# EasyEDA schematic Second_vehicle.json
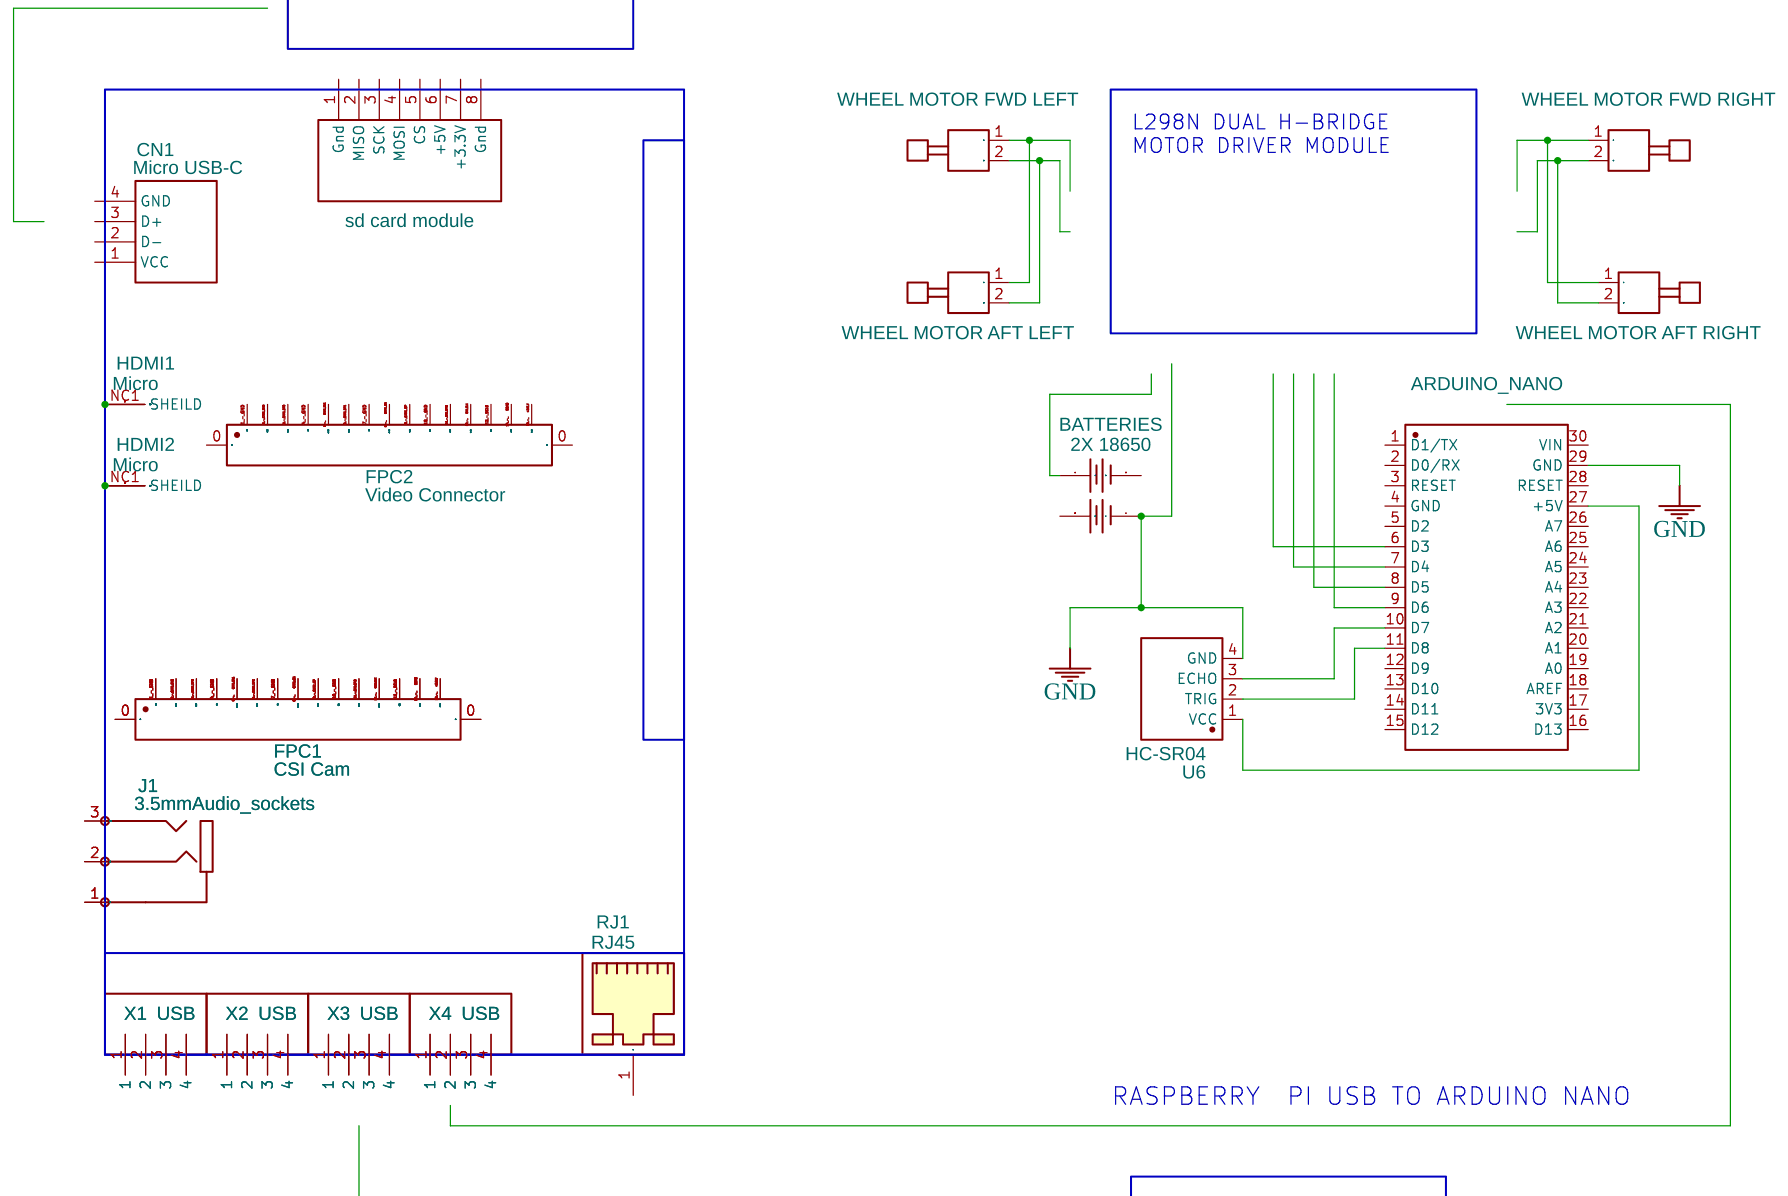
[diagram p0: schematic sheet]

## Parts
BATTERIES  2X 18650  [BAT-TH_BH-18650-A1BJ034]
CN1  Micro USB-C  [USB-A-SMD_4PIN-FEMALE_AF]
FPC1  CSI Cam  [FFC-S-C1.0-5.5-15P]
FPC2  Video Connector  [FFC-S-C1.0-5.5-15P]
HDMI1  Micro  [HDMI]
HDMI2  Micro  [HDMI]
J1  3.5mmAudio_sockets  [AUDIO-JACK-3.5]
RJ1  RJ45  [RJ45-LIGHT-90]
U1  ARDUINO_NANO  [COMM-TH_ARDUINO_NANO]
U2  WHEEL MOTOR FWD LEFT  [MOTOR_LCM04084521-B1]
U3  WHEEL MOTOR FWD RIGHT  [MOTOR_LCM04084521-B1]
U4  WHEEL MOTOR AFT LEFT  [MOTOR_LCM04084521-B1]
U5  WHEEL MOTOR AFT RIGHT  [MOTOR_LCM04084521-B1]
U6  HC-SR04  [TH_HC-SR04V]
U7  sd card module  [SD CARD MODULE W/ SD CARD]
X1  USB  [USB-A-S]
X2  USB  [USB-A-S]
X3  USB  [USB-A-S]
X4  USB  [USB-A-S]

## Library data of the parts
BATTERIES = BH-18650-A1BJ034: Supplier: LCSC; Supplier Part: C49215506; Manufacturer: MYOUNG(美阳); JLCPCB Part Class: Extended Part; Contributor: lcsc
CN1 = -: Supplier: LCSC; Manufacturer: ValuePro; Manufacturer Part: USB-CONN-AF-LCP; image: //image.lceda.cn/szlcsc/C42641.jpg; Supplier Part: C42641; Contributor: Jair Paredes
FPC1 FPC2 = -: Supplier: LCSC; Supplier Part: C247796; Manufacturer: HR; Manufacturer Part: F1003WR-S-15PNLNG1GB0R; Contributor: SoxxZ _
HDMI1 HDMI2 = -: Contributor: วิทวัส สมพงษ์; Manufacturer Part: ?
J1 = -: Supplier Part: C26230; Supplier: LCSC; Manufacturer: BOOMELE; Manufacturer Part: 3.5mmAudio sockets PJ325; image: //image.lceda.cn/szlcsc/C26230.jpg; Contributor: al.levashov; link: https://ru.aliexpress.com/store/product/100-3-5-pcb/731439_32836448676.html
RJ1 = -: Manufacturer Part: ?; Contributor: LCSC
U1 = ARDUINO_NANO: Contributor: lcsc; Supplier: LCSC; Supplier Part: C9900017879; Manufacturer: null; JLCPCB Part Class: Extended Part
U2-U5 = LCM04084521-B1: Supplier: LCSC; Supplier Part: C2992359; Manufacturer: LEADER(立得); JLCPCB Part Class: Extended Part; Contributor: lcsc
U6 = HC-SR04: Supplier: LCSC; Supplier Part: C19857336; Manufacturer: Universal Microelectronics; Contributor: lcsc; JLCPCB Part Class: Extended Part
U7 = -: Contributor: andy2468
X1-X4 = -: USB Connectors; Contributor: Pinoccio; sourceId: I6m9bZ1qQ; Manufacturer Part: ?

## Nets
GND: BATTERIES.4 U1.29(GND) U6.4(GND)
Net-(HDMI1-NC1): HDMI1.NC1(SHEILD) HDMI1.NC2(SHEILD) HDMI1.NC3(SHEILD) HDMI1.NC4(SHEILD)
Net-(HDMI2-NC1): HDMI2.NC1(SHEILD) HDMI2.NC2(SHEILD) HDMI2.NC3(SHEILD) HDMI2.NC4(SHEILD)
Net-(U1-10): U1.10(D7) U6.3(ECHO)
Net-(U1-11): U1.11(D8) U6.2(TRIG)
Net-(U1-27): U1.27(+5V) U6.1(VCC)
Net-(U2-1): U2.1 U4.1
Net-(U2-2): U2.2 U4.2
Net-(U3-1): U3.1 U5.1
Net-(U3-2): U3.2 U5.2

Not connected (* = marked no-connect by the designer): BATTERIES 1 2 3; CN1 1(VCC) 2(D-) 3(D+) 4(GND); FPC1 0 1 - GND 2 - CAM1_DN0 3 - CAM1_DP0 4 - GND 5 - 	CAM1_DN1 6 - CAM1_DP1 7 - GND 8 - 	CAM1_CN 9 - CAM1_CP 10 - GND 11 - CAM_GPIO 12 - 	CAM_CLK 13 - SCL0 14 - 	SDA0 15 - 	+3.3 V; FPC2 0 1 - GND 2 - CAM1_DN0 3 - CAM1_DP0 4 - GND 5 - 	CAM1_DN1 6 - CAM1_DP1 7 - GND 8 - 	CAM1_CN 9 - CAM1_CP 10 - GND 11 - CAM_GPIO 12 - 	CAM_CLK 13 - SCL0 14 - 	SDA0 15 - 	+3.3 V; J1 1(GND) 2(12V) 3(SIGNAL); RJ1 1; U1 1(D1/TX) 2(D0/RX) 3(RESET) 4(GND) 5(D2) 6(D3) 7(D4) 8(D5) 9(D6) 12(D9) 13(D10) 14(D11) 15(D12) 16(D13) 17(3V3) 18(AREF) 19(A0) 20(A1) 21(A2) 22(A3) 23(A4) 24(A5) 25(A6) 26(A7) 28(RESET) 30(VIN); U7 1(Gnd) 2(MISO) 3(SCK) 4(MOSI) 5(CS) 6(+5V) 7(+3.3V) 8(Gnd); X1 1 2 3 4; X2 1 2 3 4; X3 1 2 3 4; X4 1 2 3 4

## Notes on the sheet
- USB TO POWER BANK
- POWER BANK 5V - 5A
- L298N DUAL H-BRIDGE
  MOTOR DRIVER MODULE
- RASPBERRY  PI USB TO ARDUINO NANO
- RASPBERRY PI USB TO CAMERA
- USB CAMERA
